# Altium schematic sheet CBU.SchDoc
size B; Organization: MASA; SheetNumber: 1; SheetTotal: 7
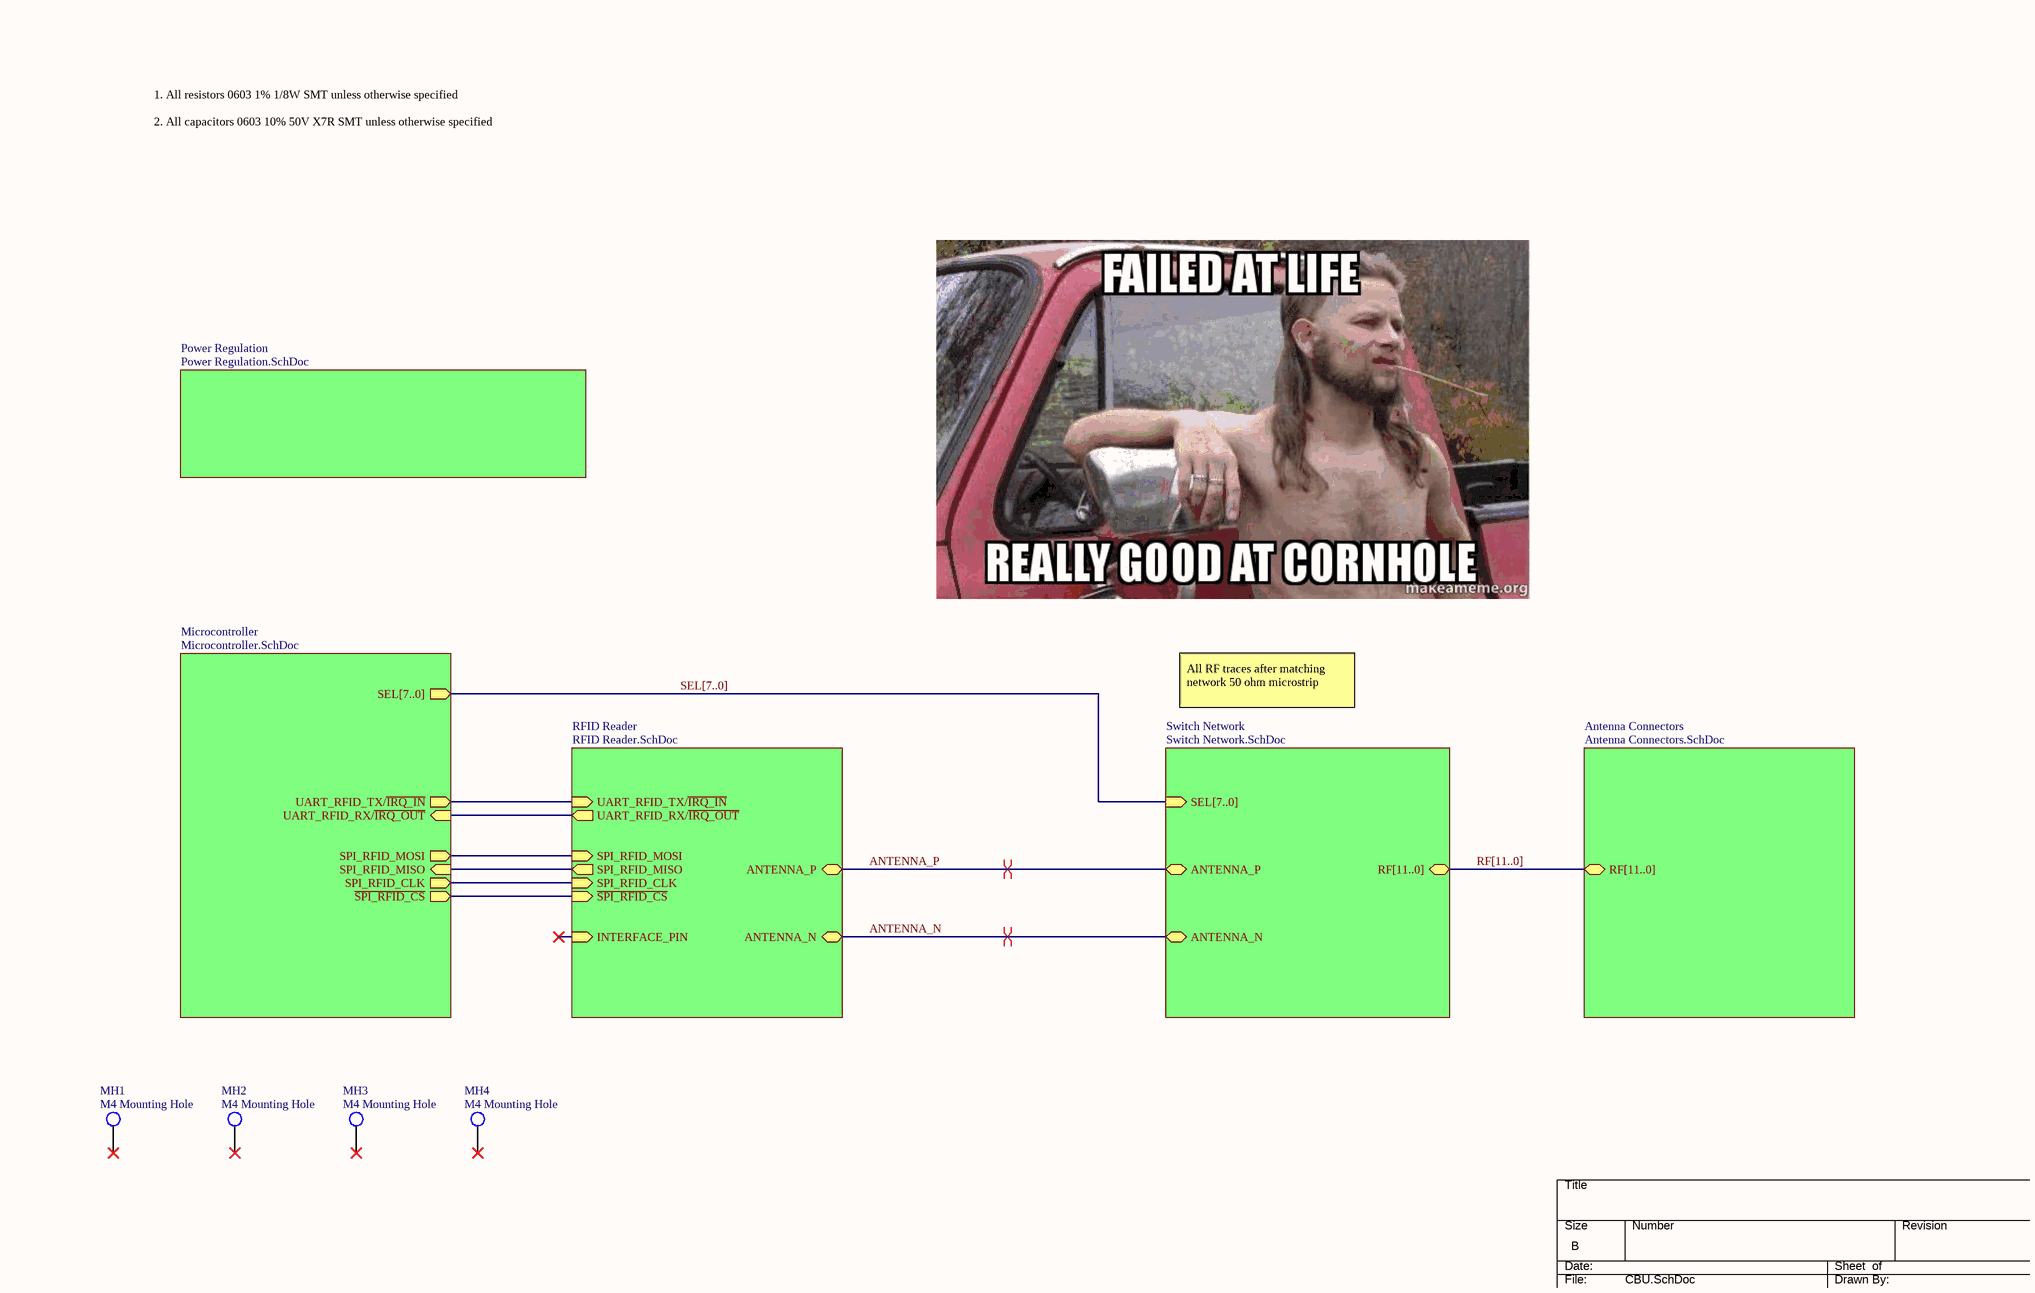
[diagram p0: CBU.SchDoc]

## Parts
MH1  M4 Mounting Hole  [M4 Mounting Hole]
MH2  M4 Mounting Hole  [M4 Mounting Hole]
MH3  M4 Mounting Hole  [M4 Mounting Hole]
MH4  M4 Mounting Hole  [M4 Mounting Hole]

## Sub-sheets
Antenna Connectors = Antenna Connectors.SchDoc: RF[11..0] (bidir)
Microcontroller = Microcontroller.SchDoc: SEL[7..0] (out), UART_RFID_TX/~{IRQ_IN} (out), UART_RFID_RX/~{IRQ_OUT} (in), SPI_RFID_MOSI (out), SPI_RFID_MISO (in), SPI_RFID_CLK (out), ~{SPI_RFID_CS} (out)
Power Regulation = Power Regulation.SchDoc: no entries
RFID Reader = RFID Reader.SchDoc: ANTENNA_N (bidir), ANTENNA_P (bidir), INTERFACE_PIN (in), UART_RFID_TX/~{IRQ_IN} (in), UART_RFID_RX/~{IRQ_OUT} (out), SPI_RFID_MOSI (in), SPI_RFID_MISO (out), SPI_RFID_CLK (in), ~{SPI_RFID_CS} (in)
Switch Network = Switch Network.SchDoc: RF[11..0] (bidir), ANTENNA_P (bidir), SEL[7..0] (in), ANTENNA_N (bidir)

## Nets
ANTENNA_N: sheet RFID Reader/ANTENNA_N, sheet Switch Network/ANTENNA_N
ANTENNA_P: sheet RFID Reader/ANTENNA_P, sheet Switch Network/ANTENNA_P
(unnamed): sheet RFID Reader/UART_RFID_TX/~{IRQ_IN}, sheet Microcontroller/UART_RFID_TX/~{IRQ_IN}
(unnamed): sheet RFID Reader/UART_RFID_RX/~{IRQ_OUT}, sheet Microcontroller/UART_RFID_RX/~{IRQ_OUT}
(unnamed): sheet RFID Reader/SPI_RFID_MOSI, sheet Microcontroller/SPI_RFID_MOSI
(unnamed): sheet RFID Reader/SPI_RFID_MISO, sheet Microcontroller/SPI_RFID_MISO
(unnamed): sheet RFID Reader/SPI_RFID_CLK, sheet Microcontroller/SPI_RFID_CLK
(unnamed): sheet RFID Reader/~{SPI_RFID_CS}, sheet Microcontroller/~{SPI_RFID_CS}

Not connected (* = marked no-connect by the designer): MH1 1*; MH2 1*; MH3 1*; MH4 1*

## Buses and harness runs
bus RF[11..0] = sheet Antenna Connectors/RF[11..0] = sheet Switch Network/RF[11..0]
bus SEL[7..0] = sheet Microcontroller/SEL[7..0] = sheet Switch Network/SEL[7..0]

## Layout directives
differential pair: ANTENNA_N, ANTENNA_P

## Notes on the sheet
- 1. All resistors 0603 1% 1/8W SMT unless otherwise specified
  2. All capacitors 0603 10% 50V X7R SMT unless otherwise specified
- All RF traces after matching network 50 ohm microstrip
- DWG. NO.
- REV.
- SHT.
- THIS DOCUMENT AND THE DATA DISCLOSED HEREIN OR HEREWITH IS THE PROPERTY OF ALTIUM LIMITED AND MAY BE FREELY DISTRIBUTED IN WHOLE. NO RIGHTS ARE RESERVED OR EXPRESS OR IMPLIED WARANTEE GIVEN.
- REVISION
- DESCRIPTION
- DATE
- APPROVED
- ENG:
- APPROVALS
- PROJECT
- DSN:
- CHK:
- REFERENCE DOCUMENTS
- PROJECT REVISION:
- TITLE
- DOCUMENT REVISION:
- DESIGN ITEM:
- BOM:
- FAB DWG:
- PCB DWG:
- ASSY DWG:
- SCALE:
- SIZE
- B
- CAGE CODE
- FILE NAME
- DWG NO.
- SHEET
- OF
- REV